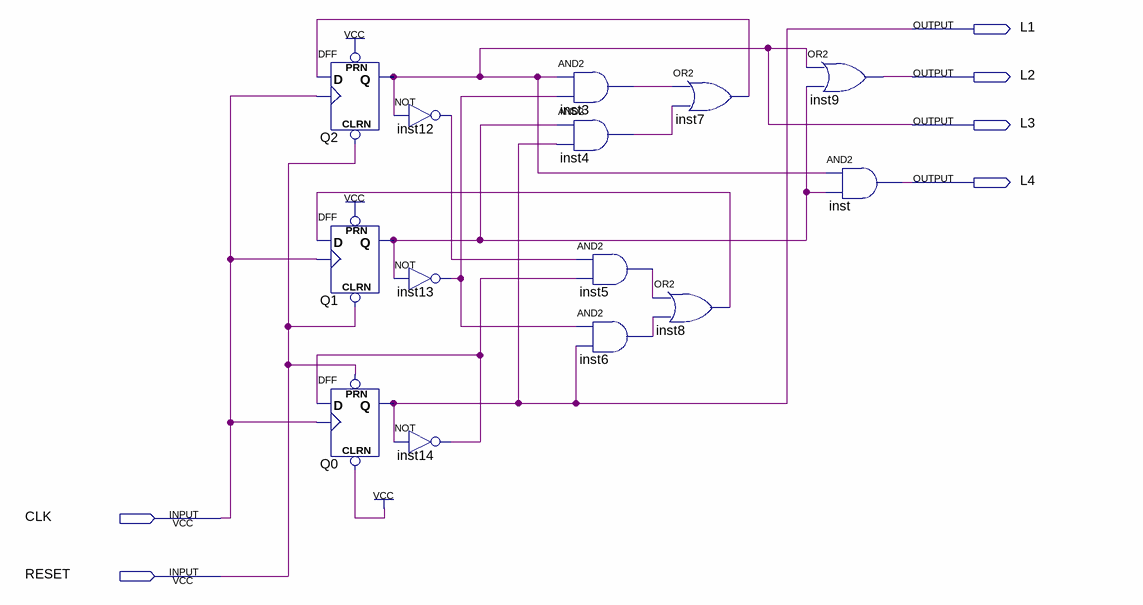
[diagram p0: schematic sheet]
// Quartus schematic dice.bdf as structural Verilog: 14 symbols, 6 pins
module dice (
  input  CLK,
  input  RESET,
  output L1,
  output L2,
  output L3,
  output L4
);

  wire inst3_out, inst4_out, inst5_out, inst6_out, inst7_out, inst8_out, inst12_out, inst13_out, inst14_out,
       Q1_q;

  DFF Q2 (.CLRN(RESET), .CLK(CLK), .D(inst7_out), .PRN(1'b1), .Q(L3));
  DFF Q1 (.CLRN(RESET), .CLK(CLK), .D(inst8_out), .PRN(1'b1), .Q(Q1_q));
  DFF Q0 (.CLRN(1'b1), .CLK(CLK), .D(inst14_out), .PRN(RESET), .Q(L1));
  not inst12 (inst12_out, L3);
  not inst13 (inst13_out, Q1_q);
  not inst14 (inst14_out, L1);
  and inst3 (inst3_out, L3, inst13_out);
  and inst4 (inst4_out, Q1_q, L1);
  and inst5 (inst5_out, inst12_out, inst14_out);
  and inst6 (inst6_out, inst13_out, L1);
  or inst8 (inst8_out, inst5_out, inst6_out);
  or inst7 (inst7_out, inst3_out, inst4_out);
  or inst9 (L2, L3, Q1_q);
  and inst (L4, L3, Q1_q);
endmodule
